# EAGLE design a202-4-band-eq (EAGLE 7.5.1)
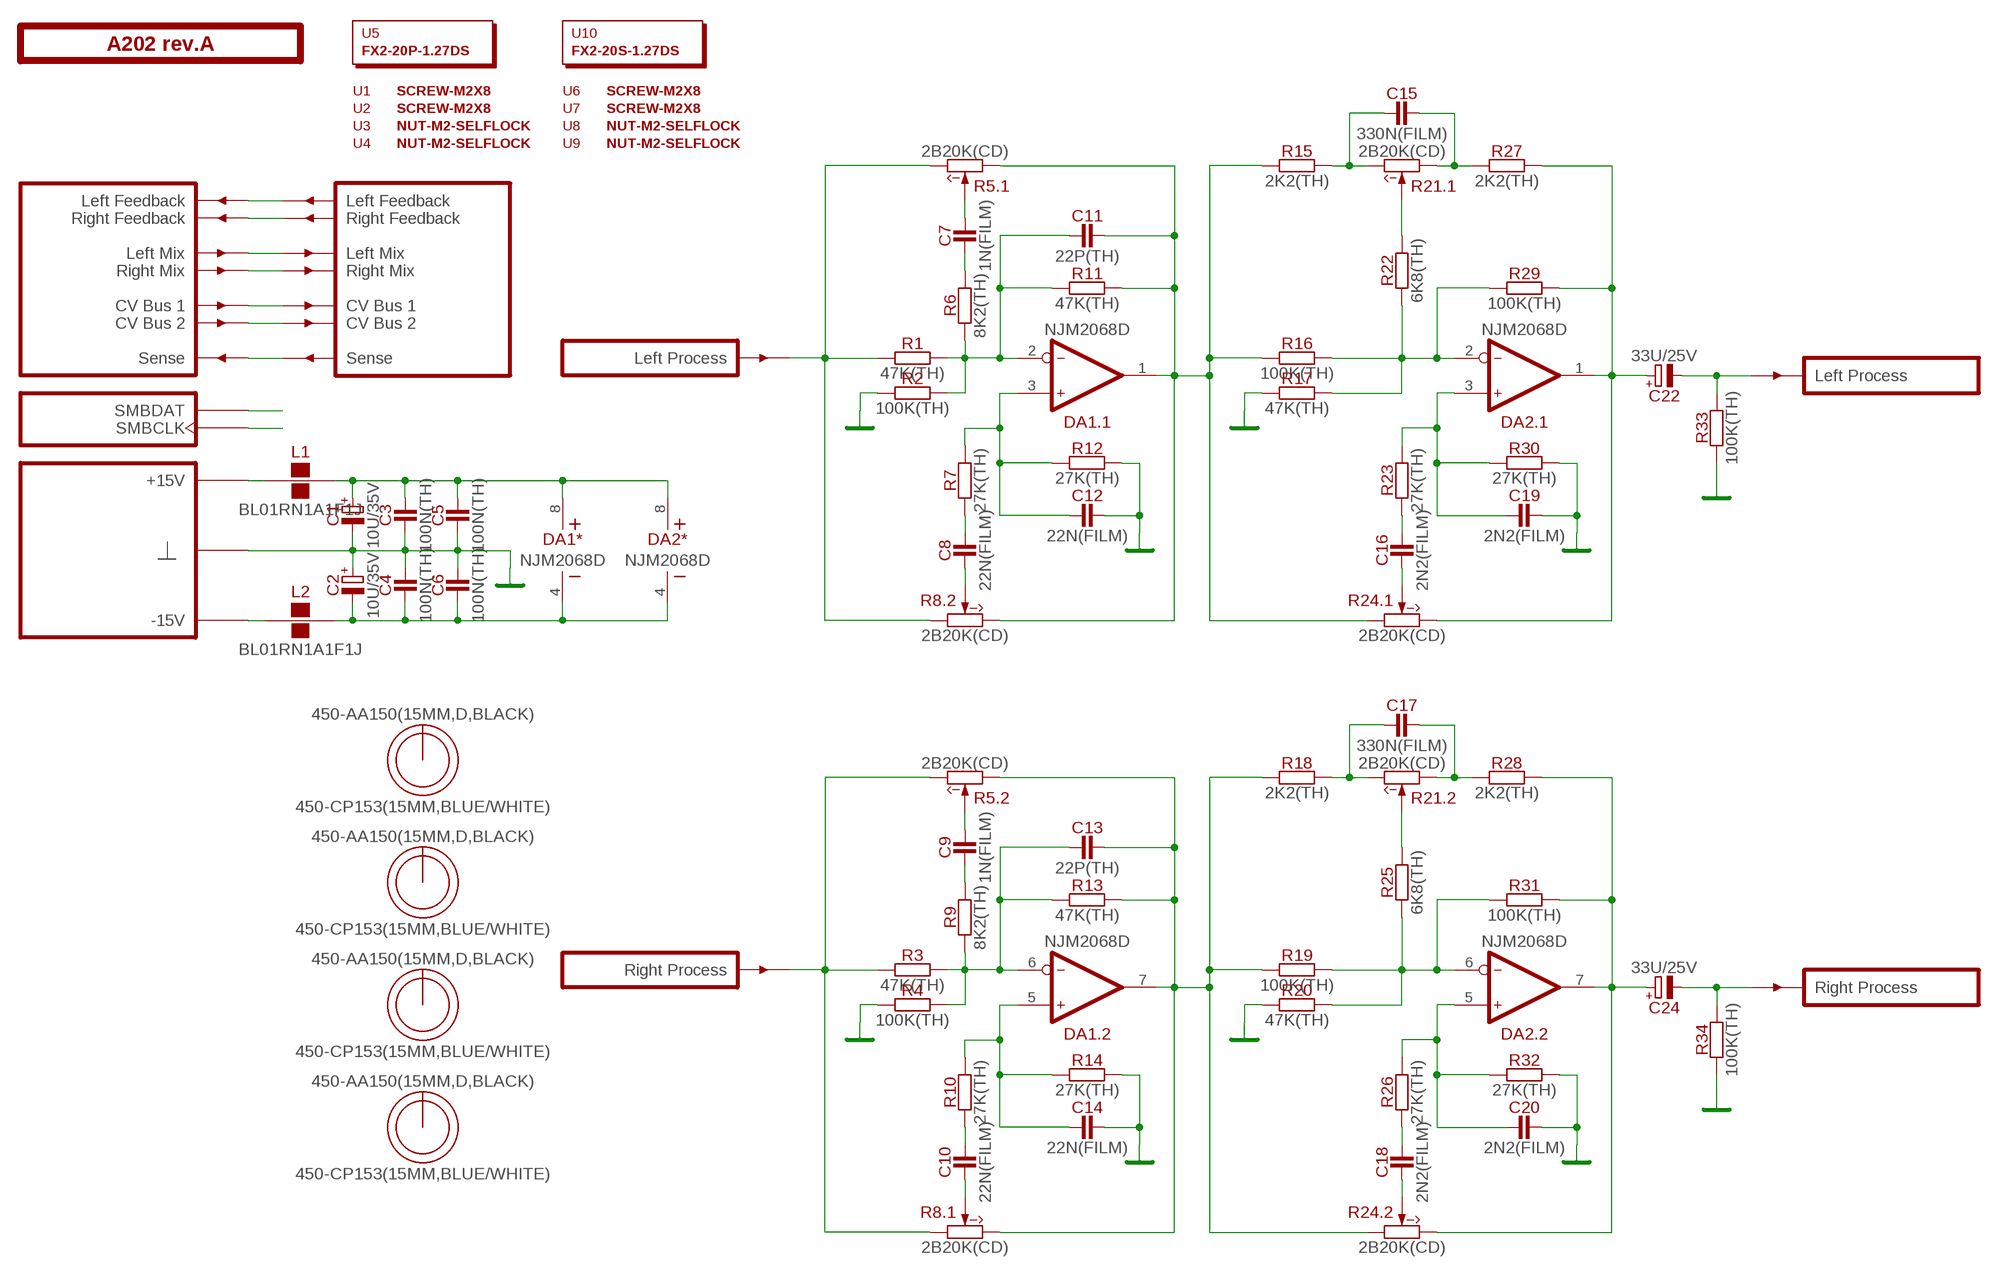
[diagram p0: schematic, sheet 1]

## Parts
C1  10U/35V  [E2-5]
C2  10U/35V  [E2-5]
C3  100N(TH)  [C050-024X044]
C4  100N(TH)  [C050-024X044]
C5  100N(TH)  [C050-024X044]
C6  100N(TH)  [C050-024X044]
C7  1N(FILM)  [C050-025X075]
C8  22N(FILM)  [C050-025X075]
C9  1N(FILM)  [C050-025X075]
C10  22N(FILM)  [C050-025X075]
C11  22P(TH)  [C050-024X044]
C12  22N(FILM)  [C050-025X075]
C13  22P(TH)  [C050-024X044]
C14  22N(FILM)  [C050-025X075]
C15  330N(FILM)  [C050-035X075]
C16  2N2(FILM)  [C050-025X075]
C17  330N(FILM)  [C050-035X075]
C18  2N2(FILM)  [C050-025X075]
C19  2N2(FILM)  [C050-025X075]
C20  2N2(FILM)  [C050-025X075]
C22  33U/25V  [E2,5-7]
C24  33U/25V  [E2,5-7]
DA1  NJM2068D  [DIP-8]
DA2  NJM2068D  [DIP-8]
L1  BL01RN1A1F1J  [BL01RN1A]
L2  BL01RN1A1F1J  [BL01RN1A]
O1  450-AA150(15MM,D,BLACK)  [EMPTY]
O2  450-AA150(15MM,D,BLACK)  [EMPTY]
O3  450-AA150(15MM,D,BLACK)  [EMPTY]
O4  450-AA150(15MM,D,BLACK)  [EMPTY]
O5  450-CP153(15MM,BLUE/WHITE)  [EMPTY]
O6  450-CP153(15MM,BLUE/WHITE)  [EMPTY]
O7  450-CP153(15MM,BLUE/WHITE)  [EMPTY]
O8  450-CP153(15MM,BLUE/WHITE)  [EMPTY]
PCB1  A202 rev.A  ST2-BOARD-50  [ST2-BOARD-50]
R1  47K(TH)  [R-0207/10]
R2  100K(TH)  [R-0207/10]
R3  47K(TH)  [R-0207/10]
R4  100K(TH)  [R-0207/10]
R5  2B20K(CD)  [RV11-DUAL]
R6  8K2(TH)  [R-0207/10]
R7  27K(TH)  [R-0207/10]
R8  2B20K(CD)  [RV11-DUAL]
R9  8K2(TH)  [R-0207/10]
R10  27K(TH)  [R-0207/10]
R11  47K(TH)  [R-0207/10]
R12  27K(TH)  [R-0207/10]
R13  47K(TH)  [R-0207/10]
R14  27K(TH)  [R-0207/10]
R15  2K2(TH)  [R-0207/10]
R16  100K(TH)  [R-0207/10]
R17  47K(TH)  [R-0207/10]
R18  2K2(TH)  [R-0207/10]
R19  100K(TH)  [R-0207/10]
R20  47K(TH)  [R-0207/10]
R21  2B20K(CD)  [RV11-DUAL]
R22  6K8(TH)  [R-0207/10]
R23  27K(TH)  [R-0207/10]
R24  2B20K(CD)  [RV11-DUAL]
R25  6K8(TH)  [R-0207/10]
R26  27K(TH)  [R-0207/10]
R27  2K2(TH)  [R-0207/10]
R28  2K2(TH)  [R-0207/10]
R29  100K(TH)  [R-0207/10]
R30  27K(TH)  [R-0207/10]
R31  100K(TH)  [R-0207/10]
R32  27K(TH)  [R-0207/10]
R33  100K(TH)  [R-0207/10]
R34  100K(TH)  [R-0207/10]
U1  SCREW-M2X8  [EMPTY]
U2  SCREW-M2X8  [EMPTY]
U3  NUT-M2-SELFLOCK  [EMPTY]
U4  NUT-M2-SELFLOCK  [EMPTY]
U5  FX2-20P-1.27DS  [EMPTY]
U6  SCREW-M2X8  [EMPTY]
U7  SCREW-M2X8  [EMPTY]
U8  NUT-M2-SELFLOCK  [EMPTY]
U9  NUT-M2-SELFLOCK  [EMPTY]
U10  FX2-20S-1.27DS  [EMPTY]

## Nets
GND: C1.- C2.+ C3.1 C4.2 C5.1 C6.2 C12.2 C14.2 C19.2 C20.2 PCB1.B4'(GND) PCB1.B4(GND) PCB1.B5'(GND) PCB1.B5(GND) PCB1.B6'(GND) PCB1.B6(GND) PCB1.B7'(GND) PCB1.B7(GND) PCB1.B8'(GND) PCB1.B8(GND) R2.1 R4.1 R12.2 R14.2 R17.1 R20.1 R30.2 R32.2 R33.1 R34.1
N$1: PCB1.ALFBK'(LFBK') PCB1.ALFBK(LFBK)
N$2: PCB1.ARFBK'(RFBK') PCB1.ARFBK(RFBK)
N$3: PCB1.ALMIX'(LMIX') PCB1.ALMIX(LMIX)
N$4: PCB1.ARMIX'(RMIX') PCB1.ARMIX(RMIX)
N$5: PCB1.ACV1'(CV1') PCB1.ACV1(CV1)
N$6: PCB1.ACV2'(CV2') PCB1.ACV2(CV2)
N$7: PCB1.BSENSE'(SENSE') PCB1.BSENSE(SENSE)
N$8: PCB1.ASMBDAT'(SMBDAT) PCB1.ASMBDAT(SMBDAT)
N$9: PCB1.ASMBCLK'(SMBCLK) PCB1.ASMBCLK(SMBCLK)
N$10: C11.1 DA1.2(.1:IN-) R1.2 R2.2 R6.1 R11.1
N$11: C11.2 DA1.1(.1:OUT) R5.1(.1:CCW) R8.3'(.2:CW) R11.2 R15.1 R16.1 R24.1(.1:CCW)
N$12: C7.1 R6.2
N$13: C7.2 R5.2(.1:W)
N$14: PCB1.BINL(INL) R1.1 R5.3(.1:CW) R8.1'(.2:CCW)
N$15: C12.1 DA1.3(.1:IN+) R7.2 R12.1
N$16: DA2.2(.1:IN-) R16.2 R17.2 R22.1 R29.1
N$17: C8.2 R7.1
N$18: C8.1 R8.2'(.2:W)
N$19: C22.+ DA2.1(.1:OUT) R24.3(.1:CW) R27.2 R29.2
N$20: C19.1 DA2.3(.1:IN+) R23.2 R30.1
N$21: C16.2 R23.1
N$22: C16.1 R24.2(.1:W)
N$23: C15.2 R21.1(.1:CCW) R27.1
N$24: C15.1 R15.2 R21.3(.1:CW)
N$25: L1.1 PCB1.A+15'(P+15V) PCB1.A+15(P+15V) PCB1.B+15'(P+15V) PCB1.B+15(P+15V)
N$26: R21.2(.1:W) R22.2
N$27: C22.- PCB1.BOUTL'(OUTL) R33.2
N$28: C13.1 DA1.6(.2:IN-) R3.2 R4.2 R9.1 R13.1
N$29: C13.2 DA1.7(.2:OUT) R5.1'(.2:CCW) R8.3(.1:CW) R13.2 R18.1 R19.1 R24.1'(.2:CCW)
N$30: C9.1 R9.2
N$31: C9.2 R5.2'(.2:W)
N$32: PCB1.BINR(INR) R3.1 R5.3'(.2:CW) R8.1(.1:CCW)
N$33: C14.1 DA1.5(.2:IN+) R10.2 R14.1
N$34: C10.2 R10.1
N$35: C10.1 R8.2(.1:W)
N$36: DA2.6(.2:IN-) R19.2 R20.2 R25.1 R31.1
N$37: C24.+ DA2.7(.2:OUT) R24.3'(.2:CW) R28.2 R31.2
N$38: C20.1 DA2.5(.2:IN+) R26.2 R32.1
N$39: C18.2 R26.1
N$40: C18.1 R24.2'(.2:W)
N$41: C17.2 R21.1'(.2:CCW) R28.1
N$42: C17.1 R18.2 R21.3'(.2:CW)
N$43: R21.2'(.2:W) R25.2
N$44: C24.- PCB1.BOUTR'(OUTR) R34.2
N$45: C1.+ C3.2 C5.2 DA1.8(*:V+) DA2.8(*:V+) L1.2
N$46: L2.1 PCB1.A-15'(P-15V) PCB1.A-15(P-15V) PCB1.B-15'(P-15V) PCB1.B-15(P-15V)
N$47: C2.- C4.1 C6.1 DA1.4(*:V-) DA2.4(*:V-) L2.2

## Library data of the parts
C1 C2 = capacitors-electrolytic:?; MOUSER: 647-USW1V100MDD
C3-C6 = capacitors:?; MOUSER: 81-RCER71H104K0A2H3B
C7 C9 C11 C13 = capacitors:?
C8 C10 C12 C14 = capacitors:?; MOUSER: 80-R82EC2220DQ50J
C15 C17 = capacitors:?; MOUSER: 505-MKS2.33/63/10
C16 C18-C20 = capacitors:?; MOUSER: 80-PHE426DJ4220JR05
C22 C24 = capacitors-electrolytic:?
DA1 DA2 = ic-jrc:NJM2068; MOUSER: 513-NJM2068D
L1 L2 = inductors:BL01RN1A?; MOUSER: 81-BL01RN1A1F1J
O1-O4 = hardware:450-AA?; MOUSER: 450-AA150
O5-O8 = hardware:450-C?; MOUSER: 450-CP153
PCB1 = module-footprints:ST2-BOARD-?
R1 R3 R6 R7 R9-R15 R17 R18 R20 R22 R23 R25-R28 R30 R32 = resistors:?
R2 R4 R16 R19 R29 R31 R33 R34 = resistors:?; MOUSER: 71-RN55D-F-100K
R5 R8 R21 R24 = potentiometers:2**?; MOUSER: 688-RK12L1230C1M
U1-U4 U6-U9 = hardware:*?
U5 = hardware:?; MOUSER: 798-FX2-20P-1.27DS71
U10 = hardware:?; MOUSER: 798-FX2-20S-1.27DS71

## Board
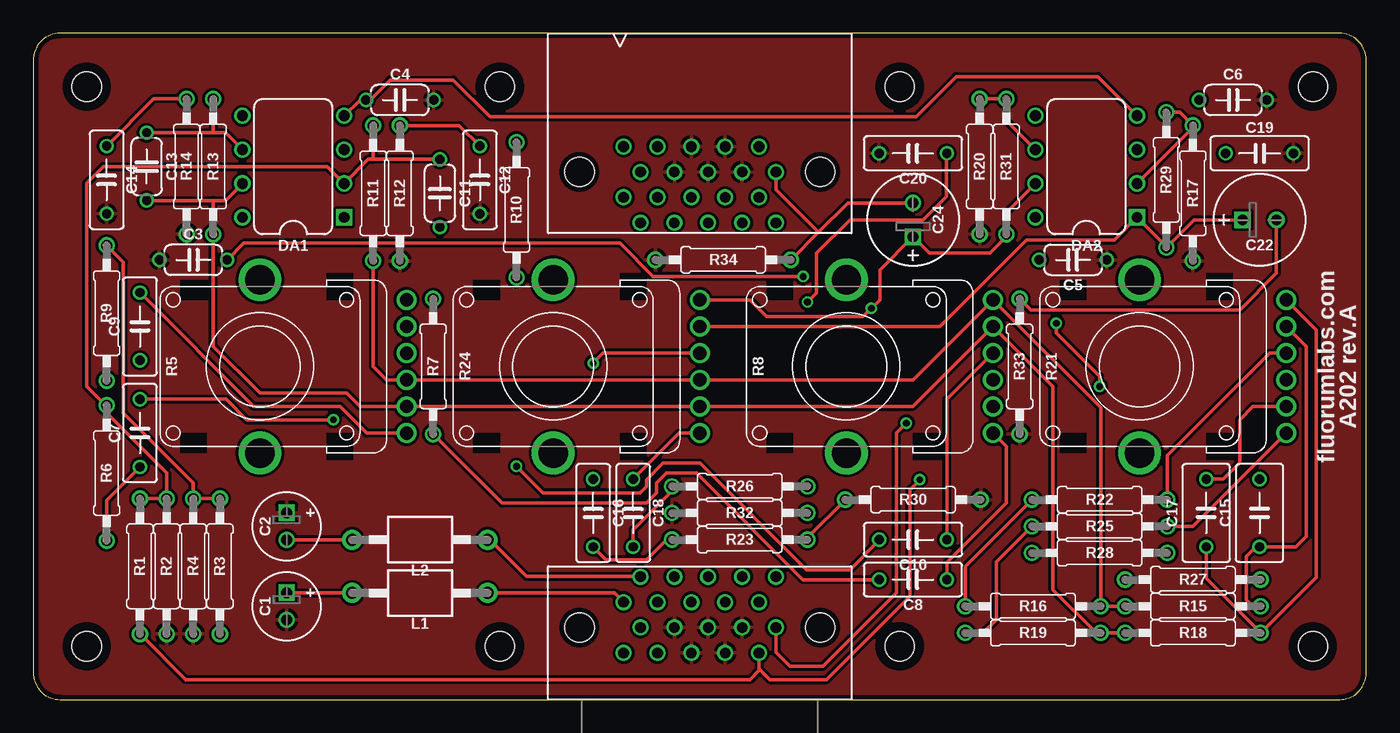
[diagram p1: board, top side]
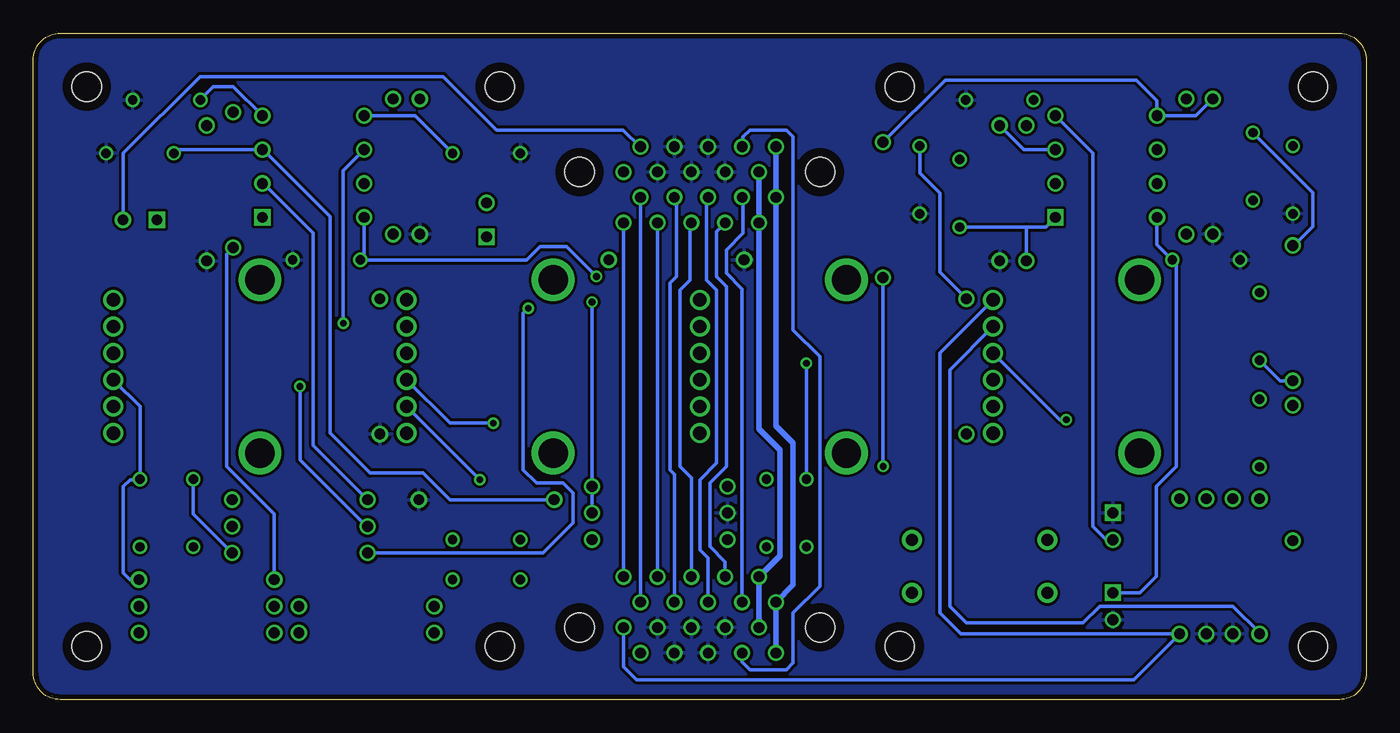
[diagram p2: board, bottom side, seen from below]

Size 100 x 50 mm. Coordinates in mm from the lower left corner, seen from the top.
Outline: 0,48 0,2 arc90 2,0 98,0 arc90 100,2 100,48 arc90 98,50 2,50 arc90 0,48
Copper layers (1*16): Top 0.0356mm / dielectric 1.5011mm / Bottom 0.0356mm
Design rules "sonictrain": minimum track width 6mil, minimum drill 13mil, track to track 8mil, track to pad 8mil, pad to pad 6mil, via to via 6mil, smd to smd 6mil, copper to edge 15mil, drill to drill 6mil, minimum pad ring 7mil, minimum via ring 7mil, stop-mask expansion 3mil, vias tented up to drill 25mil, thermal gap 10mil

### Footprints (pad centres in the part's own frame; a part is rotated, then mirrored left to right if it is on the bottom)
E2-5 = drill 0.813 square: + -1.016,0 | drill 0.813: - 1.016,0
C050-024X044 = drill 0.7: 1 -2.54,0; 2 2.54,0
C050-025X075 = drill 0.7: 1 -2.54,0; 2 2.54,0
C050-035X075 = drill 0.7: 1 -2.54,0; 2 2.54,0
E2,5-7 = drill 0.813 square: + -1.27,0 | drill 0.813: - 1.27,0
DIP-8 = drill 0.813 square: 1 -3.81,-3.81 | drill 0.813: 2 -1.27,-3.81; 3 1.27,-3.81; 4 3.81,-3.81; 5 3.81,3.81; 6 1.27,3.81; 7 -1.27,3.81; 8 -3.81,3.81
BL01RN1A = drill 0.9 pad 1.5: 1 -5.08,0; 2 5.08,0
ST2-BOARD-50 = drill 0.8: A+15 44.285,7.31; A+15' 44.285,37.69; A-15 45.555,9.215; A-15' 45.555,35.785; ACV1 51.905,7.31; ACV1' 51.905,37.69; ACV2 53.175,9.215; ACV2' 53.175,35.785; ALFBK 49.365,7.31; ALFBK' 49.365,37.69; ALMIX 46.825,7.31; ALMIX' 46.825,37.69; ARFBK 50.635,9.215; ARFBK' 50.635,35.785; ARMIX 48.095,9.215; ARMIX' 48.095,35.785; ASMBCLK 55.715,9.215; ASMBCLK' 55.715,35.785; ASMBDAT 54.445,7.31; ASMBDAT' 54.445,37.69; B4 48.095,5.405; B4' 48.095,39.595; B5 49.365,3.5; B5' 49.365,41.5; B6 50.635,5.405; B6' 50.635,39.595; B7 51.905,3.5; B7' 51.905,41.5; B8 53.175,5.405; B8' 53.175,39.595; B+15 44.285,3.5; B+15' 44.285,41.5; B-15 45.555,5.405; B-15' 45.555,39.595; BINL 54.445,3.5; BINR 55.715,5.405; BOUTL' 54.445,41.5; BOUTR' 55.715,39.595; BSENSE 46.825,3.5; BSENSE' 46.825,41.5 | hole 2.2: 4,4; 4,46; 96,4; 96,46; 35,46; 65,46; 65,4; 35,4; 59.025,5.405; 40.975,5.405; 40.975,39.595; 59.025,39.595
R-0207/10 = drill 0.813: 1 -5.08,0; 2 5.08,0
RV11-DUAL = drill 1: 1 -1,-11; 1' -3,-11; 2 1,-11; 2' -5,-11; 3 3,-11; 3' 5,-11 | drill 2.2: S1 -6.5,0; S2 6.5,0

### Placement (x,y rotation side)
C1  19,7 270 top
C2  19,13 270 top
C3  12,33 0 top
C4  27.5,45 0 top
C5  78,33 180 top
C6  90,45 0 top
C7  8,20 90 top
C8  66,9 180 top
C9  8,28 90 top
C10  66,12 180 top
C11  30.5,38 270 top
C12  33.5,39 270 top
C13  8.5,40 270 top
C14  5.5,39 270 top
C15  92,14 90 top
C16  42,14 270 top
C17  88,14 90 top
C18  45,14 270 top
C19  92,41 0 top
C20  66,41 180 top
C22  92,36 0 top
C24  66,36 90 top
DA1  19.5,40 90 top
DA2  79,40 90 top
L1  29,8 180 top
L2  29,12 180 top
O1  -8,-109.25 0 top  (outside the outline)
O2  -9,-110.5 0 top  (outside the outline)
O3  -10,-111.75 0 top  (outside the outline)
O4  -11,-113 0 top  (outside the outline)
O5  -12,-114.25 0 top  (outside the outline)
O6  -13,-115.5 0 top  (outside the outline)
O7  -14,-116.75 0 top  (outside the outline)
O8  -15,-118 0 top  (outside the outline)
PCB1  0,0 0 top
R1  8,10 90 top
R2  10,10 90 top
R3  14,10 90 top
R4  12,10 90 top
R5  2*B20K(CD)  [RV11-DUAL]  17,25 90 top
R6  5.5,17 270 top
R7  30,25 90 top
R8  2*B20K(CD)  [RV11-DUAL]  61,25 90 top
R9  5.5,29 270 top
R10  36.25,36.75 90 top
R11  25.5,38 270 top
R12  27.5,38 270 top
R13  13.5,40 270 top
R14  11.5,40 270 top
R15  87,7 0 top
R16  75,7 180 top
R17  87,38 90 top
R18  87,5 0 top
R19  75,5 180 top
R20  71,40 90 top
R21  2*B20K(CD)  [RV11-DUAL]  83,25 90 top
R22  80,15 0 top
R23  53,12 0 top
R24  2*B20K(CD)  [RV11-DUAL]  39,25 90 top
R25  80,13 0 top
R26  53,16 0 top
R27  87,9 180 top
R28  80,11 180 top
R29  85,39 270 top
R30  66,15 0 top
R31  73,40 270 top
R32  53,14 180 top
R33  74,25 90 top
R34  51.75,33 0 top
U1  34,-108 0 top  (outside the outline)
U2  37,-108 0 top  (outside the outline)
U3  46,-108 0 top  (outside the outline)
U4  49,-108 0 top  (outside the outline)
U5  28,-108 0 top  (outside the outline)
U6  40,-108 0 top  (outside the outline)
U7  43,-108 0 top  (outside the outline)
U8  52,-108 0 top  (outside the outline)
U9  55,-108 0 top  (outside the outline)
U10  31,-108 0 top  (outside the outline)

### Tracks (layer width: path | path; a pad name or v marks a point on that pad's centre or on a via)
GND
  pour Bottom: 0,0 100,0 100,50 0,50
  pour Top: 0,0 100,0 100,50 0,50
N$1
  Bottom 0.254: PCB1.ALFBK 49.37,10.62 50,11.25 50,16.5 48.75,17.75 48.75,30.75 49.5,31.5 49.5,37.55 PCB1.ALFBK'
N$2
  Bottom 0.254: PCB1.ARFBK 50.63,16.64 51.5,17.5 51.5,30.75 50.75,31.5 50.75,35.67 PCB1.ARFBK'
N$3
  Bottom 0.254: PCB1.ALMIX 46.83,30.82 48,32 48,33.75 46.75,35 46.75,37.62 PCB1.ALMIX'
N$4
  Bottom 0.254: PCB1.ARMIX 48.09,10.35 49.25,11.5 49.25,16.25 48,17.5 48,31 48.75,31.75 48.75,35.13 PCB1.ARMIX'
N$5
  Bottom 0.254: PCB1.ACV1 51.91,16.91 52.25,17.25 52.25,31.25 51.75,31.75 51.75,37.53 PCB1.ACV1'
N$6
  Bottom 0.254: PCB1.ACV2 PCB1.ACV2'
N$7
  Bottom 0.254: PCB1.BSENSE 46.83,2.83 46.25,2.25 43.5,2.25 43,2.75 43,6.5 41,8.5 41,25.75 43,27.75 43,42.25 43.5,42.75 46.25,42.75 46.75,42.25 46.75,41.58 PCB1.BSENSE'
N$8
  Bottom 0.254: PCB1.ASMBDAT' PCB1.ASMBDAT
N$9
  Bottom 0.254: PCB1.ASMBCLK PCB1.ASMBCLK'
N$10
  Top 0.254: C11.1 25.5,40.54 | 25.5,40.54 25.12,40.54 DA1.2 22.04,40 5.25,40 4,38.75 4,23.5 5.42,22.08 R6.1 5.5,21.5 10,17 R2.2 R1.2 | R11.1 25.5,40.54
N$11
  Top 0.254: R15.1 R16.1 80.08,21.92 R8.3' 66,24 R24.1 R5.1 26.5,24 25.5,25 R11.2
  Bottom 0.254: C11.2 25.5,35.46 | 25.5,35.46 24.04,35.46 DA1.1 | R11.2 25.5,35.46
N$12
  Top 0.254: R6.2 5.5,14.96 C7.1
N$13  (via drill 0.5)
  Top 0.254: C7.2 14.46,22.54 16,21 v22.5,21
  Bottom 0.254: v22.5,21 23,21 R5.2
N$14  (via drill 0.5)
  Top 0.254: R1.1 11.42,1.5 53.75,1.5 54.45,2.19 PCB1.BINL 54.45,2.31 55.25,1.5 59.5,1.5 65.75,7.75 65.75,15.75 v66.5,16.5
  Bottom 0.254: R1.1 8,5 10,7 20,7 21.25,5.75 30,5.75 31.25,7 31.25,24.75 R5.3 | v66.5,16.5 R8.1'
N$15
  Top 0.254: R12.1 31.96,43.08 C12.1
  Bottom 0.254: DA1.3 25.69,41.27 R12.1 | C12.1 33.5,39.5 32,38 32,32.08 R7.2
N$16
  Top 0.254: DA2.2 87,42.92 R17.2 86,44.08 R29.1 | R16.2 69.92,10 R22.1
  Bottom 0.254: DA2.2 82.73,38.73 79,35 79,19.08 R22.1
N$17
  Top 0.254: C8.2 57.75,9 49.75,17 47.5,17 46.75,16.25 46.75,15.5 46,14.75 35.17,14.75 R7.1
N$18
  Top 0.254: C8.1 68.54,10.29 73,14.75 73,19 R8.2'
N$19
  Top 0.254: C22.+ 87.08,36 R29.2 85,34 DA2.1 81.12,34.5 74.5,34.5 68,28 R24.3
  Bottom 0.254: R27.2 81.92,13.92 85.5,17.5 85.5,33.42 R29.2
N$20
  Top 0.254: R23.2 58.08,12.16 R30.1
  Bottom 0.254: C19.1 89.19,41.27 DA2.3 82.77,41.27 77.75,36.25 77.75,20 74.75,17 70.75,17 68.75,15 R30.1
N$21
  Top 0.254: R23.1 47.5,12 46,10.5 42.96,10.5 C16.2
N$22  (via drill 0.5)
  Top 0.254: R24.2 42.75,26 v42,25.25
  Bottom 0.254: v42,25.25 C16.1
N$23
  Bottom 0.254: R27.1 92.75,9 93.25,9.5 93.25,16 92.75,16.5 92.04,16.5 C15.2 92,22 R21.1
N$24
  Top 0.254: R15.2 91.5,7 91,7.5 91,10.75 91.5,11.25 91.79,11.25 C15.1 94.71,11.46 95.5,12.25 95.5,26.5 R21.3
N$25
  Top 0.254: L1.1 43.59,8 PCB1.A+15
  Bottom 0.406: PCB1.B+15 PCB1.A+15 43,8.6 43,19.25 44.28,20.54 PCB1.A+15' PCB1.B+15'
N$26
  Top 0.254: R22.2 85.08,18.33 92.75,26 R21.2
N$27
  Top 0.254: C22.- 93.27,32.02 90.5,29.25 74.83,29.25 R33.2
  Bottom 0.254: PCB1.BOUTL' 54.5,41.5 55.75,42.75 65.25,42.75 69.25,46.75 87.5,46.75 93.25,41 93.25,36.02 C22.-
N$28
  Top 0.254: C13.1 13.5,42.54 | 13.5,42.54 14.42,42.54 DA1.6 | R13.1 13.5,42.54 | R3.2 R4.2 12,16.25 6.75,21.5 6.75,32.83 R9.1
  Bottom 0.254: R9.1 5.42,34.08 4,35.5 4,38.04 C13.1
N$29
  Top 0.254: C13.2 13.5,37.46 | 13.5,37.46 14.42,37.46 DA1.7 | 13.5,37.46 R13.2 13.5,26.5 17,23 23.5,23 24.5,22 R5.1' R24.1' 66,22 R8.3 76.5,23.5 76.5,8.25 79.75,5 R19.1 R18.1
N$30
  Bottom 0.254: R9.2 6.46,23.92 C9.1
N$31
  Top 0.254: R5.2' 25,20 23,22 16.54,22 C9.2
N$32  (via drill 0.5)
  Top 0.254: PCB1.BINR 55.72,3.54 56.75,2.5 59.25,2.5 64.75,8 64.75,20 v65.5,20.75
  Bottom 0.254: R5.3' 32,26 32,6.5 30.42,4.92 R3.1 17.42,1.5 54.75,1.5 55.72,2.46 PCB1.BINR | v65.5,20.75 68.75,20.75 R8.1
N$33
  Top 0.254: R14.1 9.04,45.08 C14.1
  Bottom 0.254: R14.1 12.77,43.81 DA1.5 15.69,44.94 17.25,46.5 31.58,46.5 R10.2
N$34  (via drill 0.5)
  Top 0.254: C10.2 63.46,11.96 61.25,9.75 58,9.75 50,17.75 47.25,17.75 46,16.5 46,16 45.5,15.5 38.25,15.5 v36.25,17.5
  Bottom 0.254: v36.25,17.5 R10.1
N$35
  Top 0.254: C10.1 68.54,22.54 R8.2
N$36  (via drill 0.5)
  Top 0.254: R20.2 R31.1 73,43.46 DA2.6 | R19.2 71.25,5 72.25,6 72.25,10.33 R25.1 | v80,23.5 80,24.25 76.75,27.5 v76.75,28.25
  Bottom 0.254: R25.1 75,13 80,18 v80,23.5 | v76.75,28.25 76.75,39.71 DA2.6
N$37  (via drill 0.5)
  Top 0.254: DA2.7 73,36.54 R31.2 73,34.75 71.75,33.5 67.23,33.5 C24.+ 63.5,32.23 63.5,30 v62.88,29.38 62.25,28.75 55,28.75 53.75,30 R24.3'
  Bottom 0.254: R28.2 61.75,11 59.5,13.25 59.5,15.5 60.25,16.25 62.25,16.25 63.25,17.25 63.25,29 63.12,29.12 v62.88,29.38
N$38  (via drill 0.5)
  Top 0.254: C20.1 68.5,40.96 68.5,37.75 66.75,36 61.25,36 58.75,33.5 58.75,30.5 v58.08,29.83
  Bottom 0.254: DA2.5 71.35,43.81 C20.1 | v58.08,29.83 R26.2 R32.1
N$39
  Top 0.254: R26.1 47.92,15.67 45,12.75 C18.2
N$40
  Top 0.254: R24.2' 48.46,20 C18.1
N$41
  Top 0.254: C17.2 89.29,16.54 90.5,17.75 90.5,21 91.5,22 R21.1'
  Bottom 0.254: C17.2 88,13.92 R28.1
N$42
  Top 0.254: C17.1 88,9.08 R18.2 96.25,9.17 96.25,27.75 R21.3'
N$43
  Top 0.254: R25.2 87,13 R21.2'
N$44
  Top 0.254: C24.- 61.1,37.27 58.91,35.09 | 58.91,35.09 R34.2 | PCB1.BOUTR' 55.72,38.28 58.91,35.09
N$45  (via drill 0.5)
  Top 0.254: C1.+ 23.9,8.02 L1.2 | v57.75,31.75 46.5,31.75 44,34.25 15.79,34.25 C3.2
  Bottom 0.254: DA1.8 15.69,34.15 C3.2 14.25,32.71 14.25,17.5 15.75,16 15.75,9.25 16.98,8.02 C1.+ | DA2.8 75.19,33.27 C5.2 63,33 62,34 60,34 v57.75,31.75
N$46
  Top 0.254: L2.1 34.25,12 37,9.25 45.52,9.25 PCB1.A-15
  Bottom 0.406: PCB1.B-15 PCB1.A-15 44,10.77 44,18.75 45.55,20.3 PCB1.A-15' PCB1.B-15'
N$47
  Top 0.254: DA1.4 24.5,45 C4.1 25.25,45 26.75,46.5 31.5,46.5 34.25,43.75 66.25,43.75 69.25,46.75 79.87,46.75 DA2.4 | L2.2 19.02,12 C2.-
  Bottom 0.254: C6.1 87.46,45.04 86.5,46 85,46 DA2.4 | C2.- 19.48,11.98 20.5,13 20.5,41 DA1.4